# EAGLE design NFC_Business_Card_No_SilkScreen_Just_Traces_with_LED_on_Map (EAGLE 9.6.2)
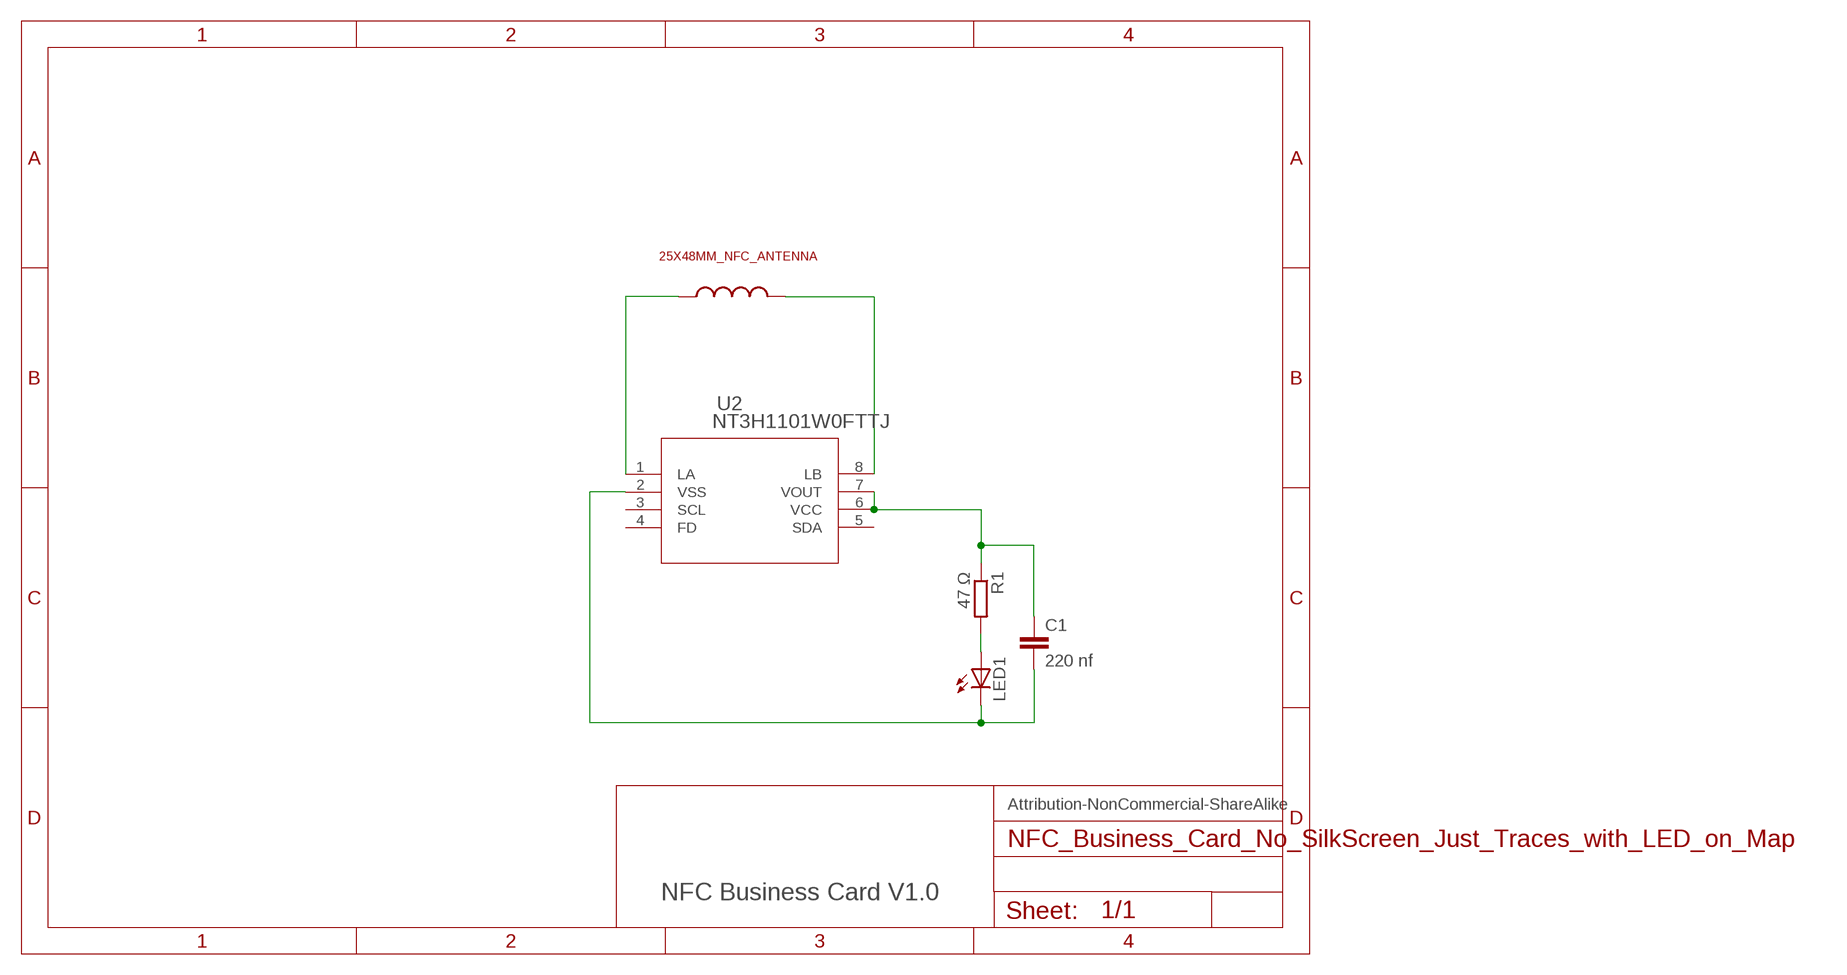
[diagram p0: schematic, sheet 1]

## Parts
ANT  25X48MM_NFC_ANTENNA  [25X48MM_NFC]
C1  220 nf  C-EUC0603  [C0603]
LED1  LEDSML0805  [SML0805]
R1  47 Ω  R-EU_R0603  [R0603]
U2  NT3H1101W0FTTJ  [TSSOP8_SOT505-1_NXP]

## Nets
N$1: ANT.P$1 U2.8(LB)
N$2: C1.2 LED1.C U2.2(VSS)
N$3: ANT.P$2 U2.1(LA)
N$6: C1.1 R1.1 U2.6(VCC) U2.7(VOUT)
N$42: LED1.A R1.2
Unconnected: U2.3(SCL) U2.4(FD) U2.5(SDA)

## Notes on the sheet
- Attribution-NonCommercial-ShareAlike
- NFC Business Card V1.0

## Library data of the parts
ANT = PCB_BusinessCard:25X48MM_NFC_ANTENNA: 25x48 mm NFC loop antenna, L = 2,75 µH
C1 = resistor:C-EU: CAPACITOR, European symbol
LED1 = led:LED: LED OSRAM: - CHIPLED LG R971, LG N971, LY N971, LG Q971, LY Q971, LO R971, LY R971 LH N974, LH R974 LS Q976, LO Q976, LY Q976 LO Q996 - Hyper CHIPLED LW Q18S LB Q993, LB Q99A, LB R99A - SideLED LS A670, LO A670, LY A670, LG A670, LP A670 LB A673, LV A673, LT A673, LW A673 LH A674 LY A675 LS A676, LA A676, LO A676, LY A676, LW A676 LS A679, LY A679, LG A679 - Hyper Micro SIDELED® LS Y876, LA Y876, LO Y876, LY Y876 LT Y87S - SmartLED LW L88C, LW L88S LB L89C, LB L89S, LG L890 LS L89K, LO L89K, LY L89K LS L896, LA L896, LO L896, LY L896 - TOPLED LS T670, LO T670, LY T670, LG T670, LP T670 LSG T670, LSP T670, LSY T670, LOP T670, LYG T670 LG T671, LOG T671, LSG T671 LB T673, LV T673, LT T673, LW T673 LH T674 LS T676, LA T676, LO T676, LY T676, LB T676, LH T676, LSB T676, LW T676 LB T67C, LV T67C, LT T67C, LS T67K, LO T67K, LY T67K, LW E67C LS E67B, LA E67B, LO E67B, LY E67B, LB E67C, LV E67C, LT E67C LW T67C LS T679, LY T679, LG T679 LS T770, LO T770, LY T770, LG T770, LP T770 LB T773, LV T773, LT T773, LW T773 LH T774 LS E675, LA E675, LY E675, LS T675 LS T776, LA T776, LO T776, LY T776, LB T776 LHGB T686 LT T68C, LB T68C - Hyper Mini TOPLED® LB M676 - Mini TOPLED Santana® LG M470 LS M47K, LO M47K, LY M47K Source: http://www.osram.convergy.de LUXEON: - LUMILED® LXK2-PW12-R00, LXK2-PW12-S00, LXK2-PW14-U00, LXK2-PW14-V00 LXK2-PM12-R00, LXK2-PM12-S00, LXK2-PM14-U00 LXK2-PE12-Q00, LXK2-PE12-R00, LXK2-PE12-S00, LXK2-PE14-T00, LXK2-PE14-U00 LXK2-PB12-K00, LXK2-PB12-L00, LXK2-PB12-M00, LXK2-PB14-N00, LXK2-PB14-P00, LXK2-PB14-Q00 LXK2-PR12-L00, LXK2-PR12-M00, LXK2-PR14-Q00, LXK2-PR14-R00 LXK2-PD12-Q00, LXK2-PD12-R00, LXK2-PD12-S00 LXK2-PH12-R00, LXK2-PH12-S00 LXK2-PL12-P00, LXK2-PL12-Q00, LXK2-PL12-R00 Source: www.luxeon.com KINGBRIGHT: KA-3528ASYC Source: www.kingbright.com
R1 = resistor:R-EU_: RESISTOR, European symbol
U2 = NT3H1101W0FTTJ:NT3H1101W0FTTJ; COPYRIGHT: Copyright (C) 2023 Ultra Librarian. All rights reserved.; MANUFACTURER_PART_NUMBER: NT3H1101W0FTTJ; MFR_NAME: NXP; TYPE: RF

## Board
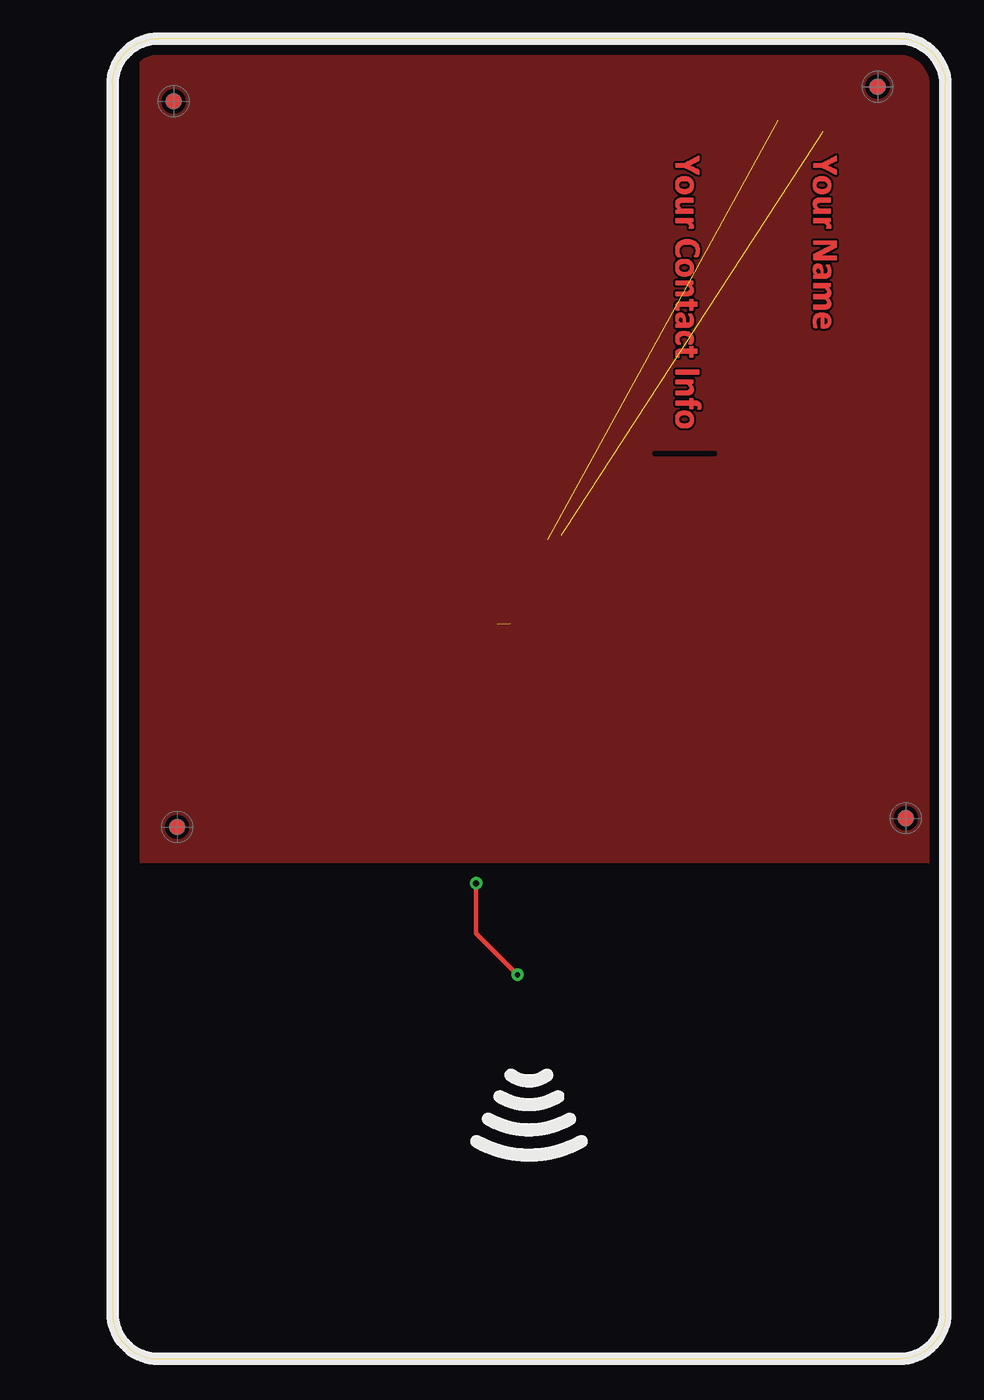
[diagram p1: board, top side]
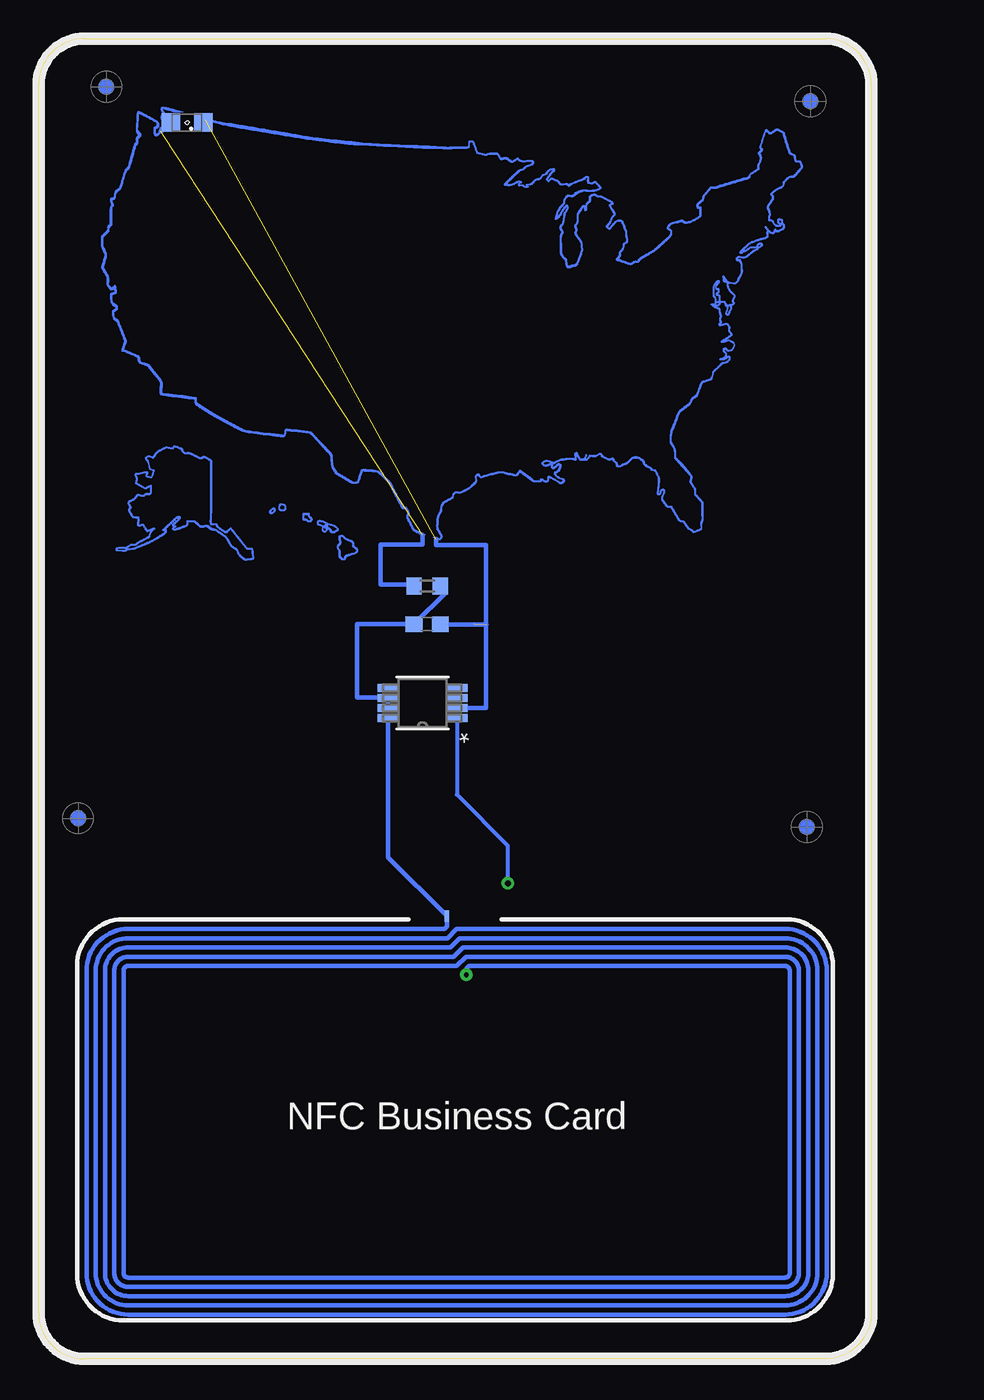
[diagram p2: board, bottom side, seen from below]

Size 54 x 85.6 mm. Coordinates in mm from the lower left corner, seen from the top.
Outline: 3,0 51,0 arc90 54,3 54,82.6 arc90 51,85.6 3,85.6 arc90 0,82.6 0,3 arc90 3,0
Copper layers (1*16): Top 0.035mm / dielectric 1.5mm / Bottom 0.035mm
Design rules "default": minimum track width 6mil, minimum drill 0.35mm, track to track 6mil, track to pad 6mil, pad to pad 6mil, via to via 6mil, smd to smd 6mil, copper to edge 40mil, drill to drill 6mil, minimum pad ring 10mil, minimum via ring 8mil, stop-mask expansion 4mil, vias tented up to drill 0mil, thermal gap 10mil
bRestrict: area 2.1,2.2 to 51.6,28.9

### Footprints (pad centres in the part's own frame; a part is rotated, then mirrored left to right if it is on the bottom)
25X48MM_NFC = smd 0.3 x 0.75: P$1 -0.635,13.335 | drill 0.3: P$2 0.635,9.525
C0603 = smd 1.1 x 1: 1 -0.85,0; 2 0.85,0
SML0805 = smd 1.2 x 1.2: A 1.05,0; C -1.05,0
R0603 = smd 1 x 1.1: 1 -0.85,0; 2 0.85,0
TSSOP8_SOT505-1_NXP = smd 1.359 x 0.508: 1 -2.229,0.975; 2 -2.229,0.325; 3 -2.229,-0.325; 4 -2.229,-0.975; 5 2.229,-0.975; 6 2.229,-0.325; 7 2.229,0.325; 8 2.229,0.975

### Placement (x,y rotation side)
ANT  26.89,15.38 0 bottom
C1  28.8,47.63 0 bottom
LED1  44.37,80.15 180 bottom
R1  28.8,50.1 180 bottom
U2  29.11,42.52 180 bottom
U$1  [FIDUCIAL_G10]  3.96,81.54 0 bottom
U$3  [FIDUCIAL_G10]  51.44,35.05 0 top
U$4  [FIDUCIAL_G10]  49.61,82.48 0 top
U$5  [FIDUCIAL_G10]  3.96,81.53 0 top
U$7  [FIDUCIAL_G10]  49.61,82.47 0 bottom
U$8  [FIDUCIAL_G10]  51.44,35.05 0 bottom
U$9  [FIDUCIAL_G10]  4.19,34.49 0 bottom
U$10  [FIDUCIAL_G10]  4.19,34.49 0 top

### Tracks (layer width: path | path; a pad name or v marks a point on that pad's centre or on a via)
N$1
  Bottom 0.305: U2.8 31.34,32.52 ANT.P$1
N$2  (2 unrouted)
  Bottom 0.152: 25.78,47.66 25.8,47.66
  Bottom 0.305: 27.93,47.61 C1.2 24.99,47.62 | 24.99,47.62 24.97,47.62 | U2.2 24.99,42.2 24.99,47.62 | LED1.C 43.16,80.31 arc-45 42.88,80.19 | 24.99,47.62 24.99,52.77 28.22,52.77 28.22,53.11
N$3  (via drill 0.4)
  Top 0.305: ANT.P$2 23.57,27.59 v23.57,30.84
  Bottom 0.254: U2.1 26.88,36.58 23.57,33.27 v23.57,30.84
N$6
  Bottom 0.25: R1.1 27.59,49.69
  Bottom 0.254: U2.6 U2.7
  Bottom 0.305: 27.59,49.69 C1.1 | C1.1 29.68,47.61 | C1.1 33.35,47.63 33.35,42.88 31.34,42.88 U2.6
N$9
  pour Top: 1.83,84.5 51,84.5 arc-90 53,82.5 53,32.22 1.83,32.22
N$42  (1 unrouted)
  Bottom 0.254: 30,50.1 R1.2 30.04,49.71
  Bottom 0.305: 29.65,50.09 R1.2 29.65,50.22 31.83,50.22 31.83,52.81 29.11,52.81 29.11,53.42 | 45.57,80.09 45.51,80.15 LED1.A arc-45 45.57,80.09 | 46.08,79.59 arc45 46.05,79.6 45.57,80.09
(copper drawn outside any net)
  shapes: Bottom area x6061, Top area x1195

### Text on the board
Top: C:/Users/gegendy/OneDrive - Microsoft/Projects/Sensor packs/BusinessCard100/images/Generic text.bmp
Bottom: C:/Users/gegendy/OneDrive - Microsoft/Projects/Sensor packs/BusinessCard100/images/USA Map -2 flipped - bitmap - Copy.bmp
bPlace: NFC Business Card